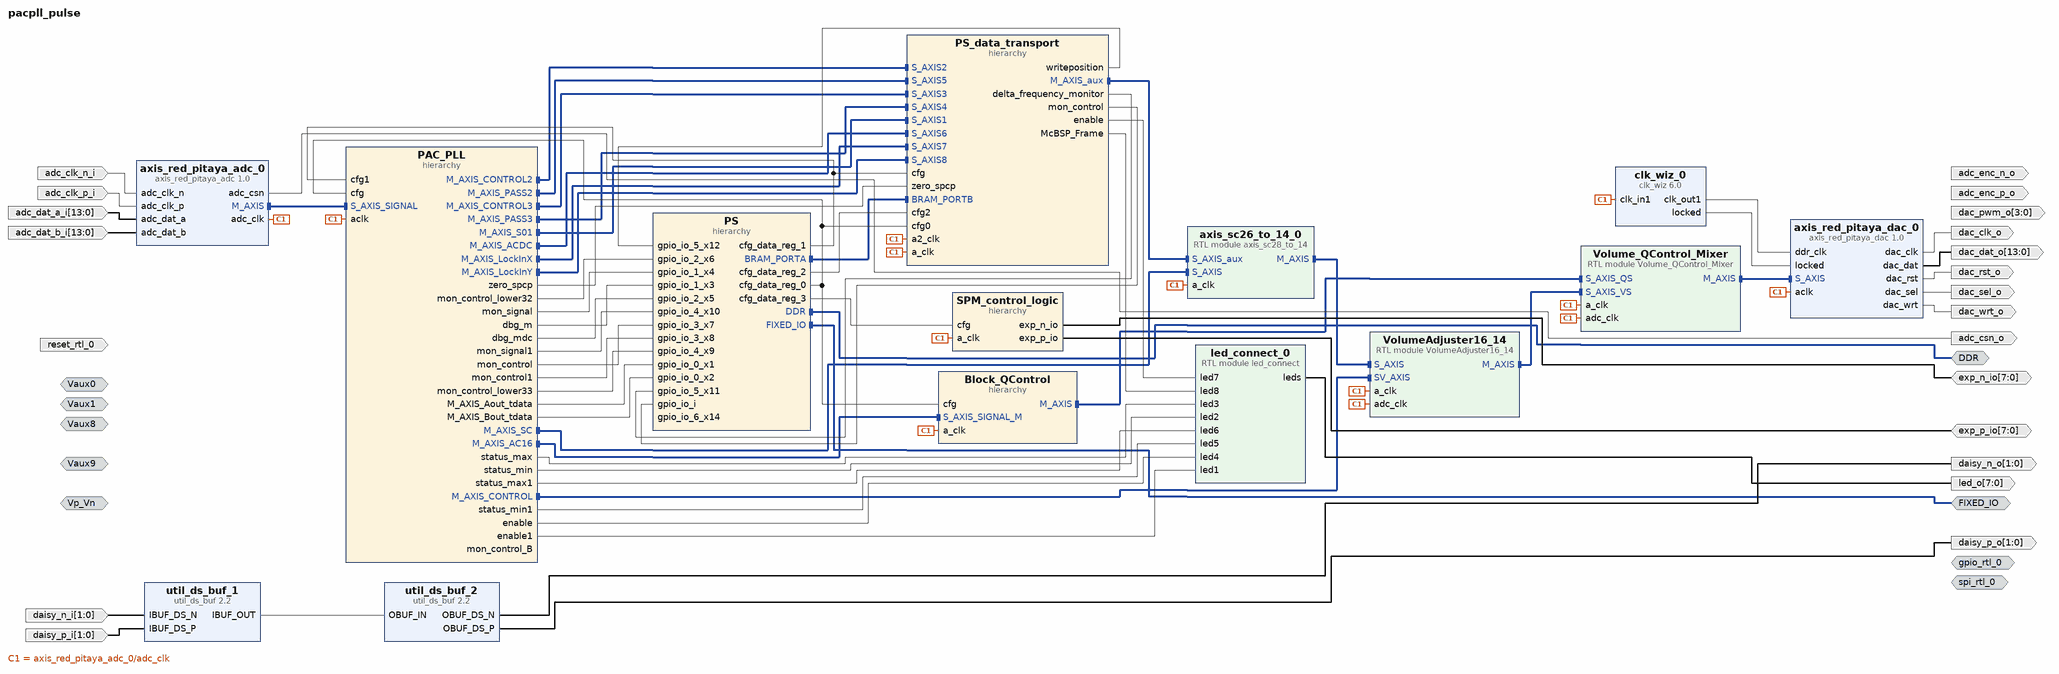
[diagram p0: block diagram of the top level]
# Vivado block design pacpll_pulse, xc7z020clg400-1, Vivado 2022.1.2
create_bd_design pacpll_pulse

create_bd_intf_port -mode Master -vlnv xilinx.com:interface:ddrx_rtl:1.0 DDR
create_bd_intf_port -mode Master -vlnv xilinx.com:display_processing_system7:fixedio_rtl:1.0 FIXED_IO
create_bd_intf_port -mode Slave -vlnv xilinx.com:interface:diff_analog_io_rtl:1.0 Vaux0
create_bd_intf_port -mode Slave -vlnv xilinx.com:interface:diff_analog_io_rtl:1.0 Vaux1
create_bd_intf_port -mode Slave -vlnv xilinx.com:interface:diff_analog_io_rtl:1.0 Vaux8
create_bd_intf_port -mode Slave -vlnv xilinx.com:interface:diff_analog_io_rtl:1.0 Vaux9
create_bd_intf_port -mode Slave -vlnv xilinx.com:interface:diff_analog_io_rtl:1.0 Vp_Vn
create_bd_intf_port -mode Master -vlnv xilinx.com:interface:gpio_rtl:1.0 gpio_rtl_0
create_bd_intf_port -mode Master -vlnv xilinx.com:interface:spi_rtl:1.0 spi_rtl_0
create_bd_port -dir I adc_clk_n_i
create_bd_port -dir I adc_clk_p_i
create_bd_port -dir O adc_csn_o
create_bd_port -dir I -from 13 -to 0 adc_dat_a_i
create_bd_port -dir I -from 13 -to 0 adc_dat_b_i
create_bd_port -dir O adc_enc_n_o
create_bd_port -dir O adc_enc_p_o
create_bd_port -dir O dac_clk_o
create_bd_port -dir O -from 13 -to 0 dac_dat_o
create_bd_port -dir O -from 3 -to 0 dac_pwm_o
create_bd_port -dir O dac_rst_o
create_bd_port -dir O dac_sel_o
create_bd_port -dir O dac_wrt_o
create_bd_port -dir I -from 1 -to 0 daisy_n_i
create_bd_port -dir O -from 1 -to 0 daisy_n_o
create_bd_port -dir I -from 1 -to 0 daisy_p_i
create_bd_port -dir O -from 1 -to 0 daisy_p_o
create_bd_port -dir IO -from 7 -to 0 exp_n_io
create_bd_port -dir IO -from 7 -to 0 exp_p_io
create_bd_port -dir O -from 7 -to 0 led_o
create_bd_port -dir I -type rst reset_rtl_0
set_property -dict {CONFIG.POLARITY ACTIVE_HIGH} [get_bd_ports reset_rtl_0]

create_bd_cell -type hier PS
create_bd_cell -type hier PS_data_transport
create_bd_cell -type module -reference VolumeAdjuster16_14 VolumeAdjuster16_14
create_bd_cell -type module -reference Volume_QControl_Mixer Volume_QControl_Mixer
create_bd_cell -type ip -vlnv pavel-demin:user:axis_red_pitaya_adc:1.0 axis_red_pitaya_adc_0
create_bd_cell -type ip -vlnv pavel-demin:user:axis_red_pitaya_dac:1.0 axis_red_pitaya_dac_0
create_bd_cell -type module -reference axis_sc28_to_14 axis_sc26_to_14_0
set_property -dict {CONFIG.SRC_BITS 25} [get_bd_cells axis_sc26_to_14_0]
create_bd_cell -type module -reference led_connect led_connect_0
create_bd_cell -type ip -vlnv xilinx.com:ip:clk_wiz:6.0 clk_wiz_0
set_property -dict [list \
  CONFIG.CLKIN1_JITTER_PS 80.0 \
  CONFIG.CLKIN2_JITTER_PS 166.66 \
  CONFIG.CLKOUT1_JITTER 104.759 \
  CONFIG.CLKOUT1_PHASE_ERROR 96.948 \
  CONFIG.CLKOUT1_REQUESTED_OUT_FREQ 250 \
  CONFIG.CLKOUT2_JITTER 137.150 \
  CONFIG.CLKOUT2_PHASE_ERROR 96.948 \
  CONFIG.CLKOUT2_REQUESTED_OUT_FREQ 62.5 \
  CONFIG.CLKOUT2_USED true \
  CONFIG.MMCM_CLKFBOUT_MULT_F 8.000 \
  CONFIG.MMCM_CLKIN1_PERIOD 8.000 \
  CONFIG.MMCM_CLKIN2_PERIOD 10.000 \
  CONFIG.MMCM_CLKOUT0_DIVIDE_F 4.000 \
  CONFIG.MMCM_CLKOUT1_DIVIDE 16 \
  CONFIG.MMCM_DIVCLK_DIVIDE 1 \
  CONFIG.NUM_OUT_CLKS 2 \
  CONFIG.PRIM_IN_FREQ 125 \
  CONFIG.SECONDARY_SOURCE Single_ended_clock_capable_pin \
  CONFIG.USE_INCLK_SWITCHOVER false \
  CONFIG.USE_RESET false \
] [get_bd_cells clk_wiz_0]
create_bd_cell -type ip -vlnv xilinx.com:ip:util_ds_buf:2.2 util_ds_buf_1
set_property -dict {CONFIG.C_SIZE 2} [get_bd_cells util_ds_buf_1]
create_bd_cell -type ip -vlnv xilinx.com:ip:util_ds_buf:2.2 util_ds_buf_2
set_property -dict {CONFIG.C_BUF_TYPE OBUFDS CONFIG.C_SIZE 2} [get_bd_cells util_ds_buf_2]
create_bd_cell -type hier PAC_PLL
create_bd_cell -type hier Block_QControl
create_bd_cell -type hier SPM_control_logic

# ---- hierarchy /PS ----
current_bd_instance /PS
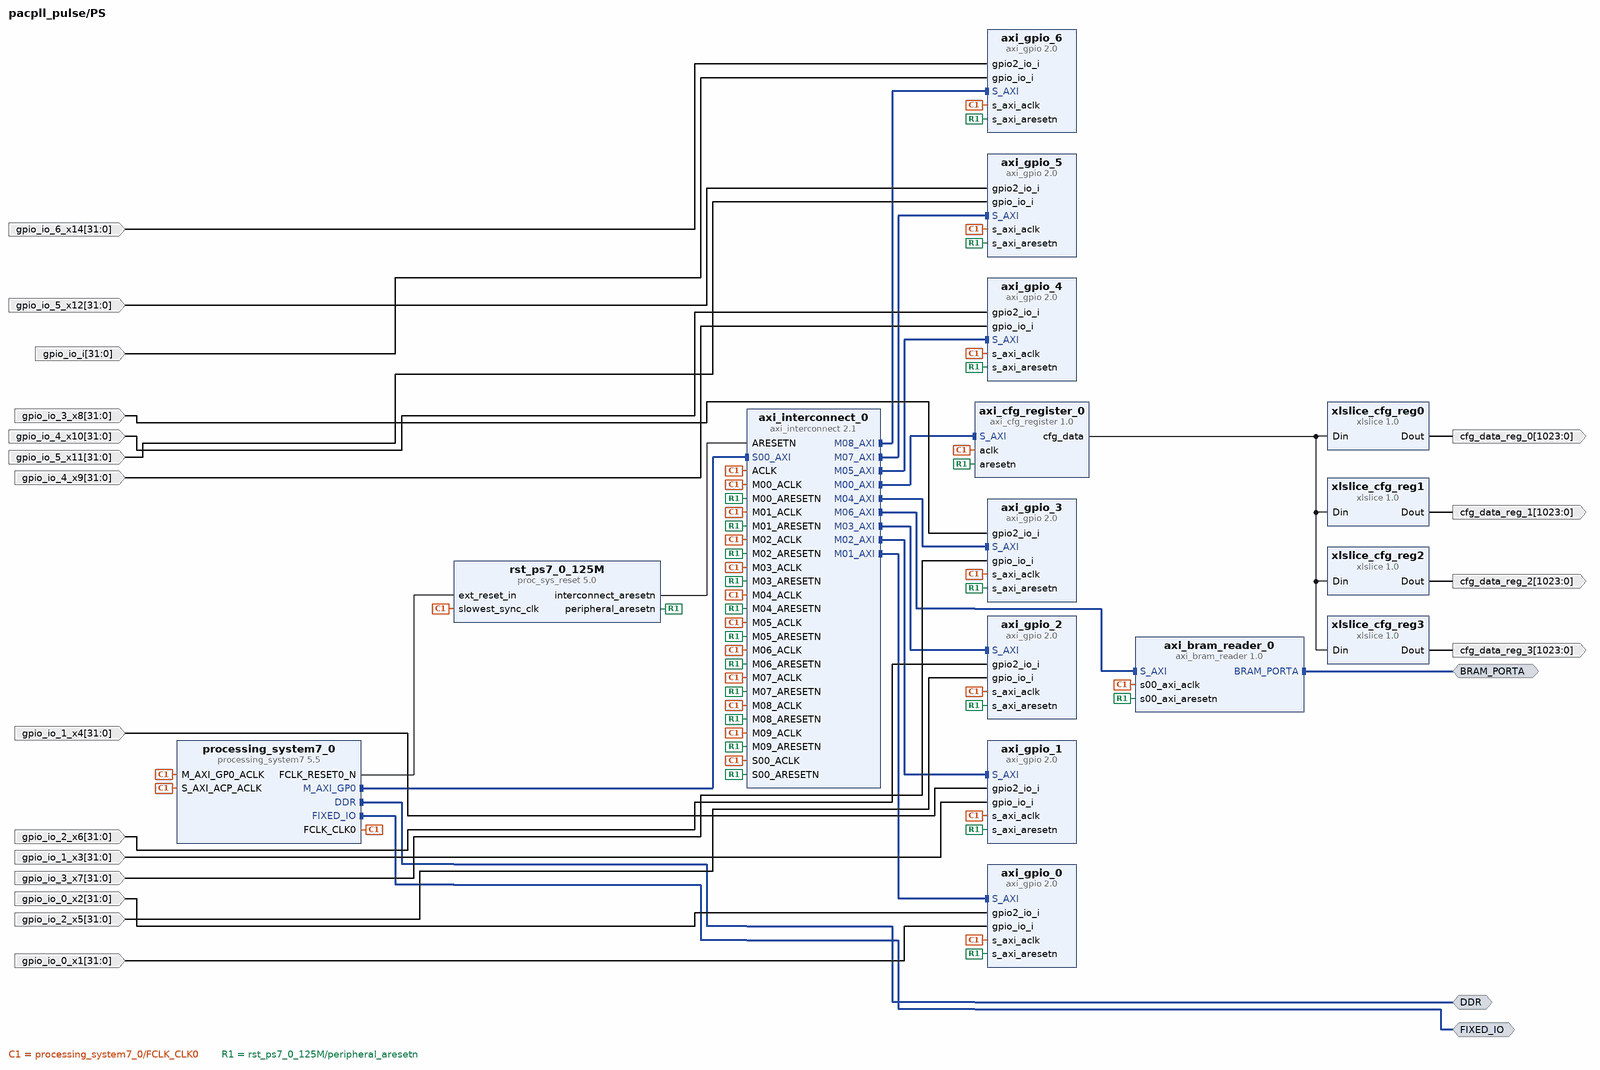
[diagram p1: block diagram inside /PS]
create_bd_intf_pin -mode Master -vlnv xilinx.com:interface:bram_rtl:1.0 BRAM_PORTA
create_bd_intf_pin -mode Master -vlnv xilinx.com:interface:ddrx_rtl:1.0 DDR
create_bd_intf_pin -mode Master -vlnv xilinx.com:display_processing_system7:fixedio_rtl:1.0 FIXED_IO
create_bd_pin -dir O -from 1023 -to 0 cfg_data_reg_0
create_bd_pin -dir O -from 1023 -to 0 cfg_data_reg_1
create_bd_pin -dir I -from 31 -to 0 gpio_io_0_x1
create_bd_pin -dir I -from 31 -to 0 gpio_io_0_x2
create_bd_pin -dir I -from 31 -to 0 gpio_io_1_x3
create_bd_pin -dir I -from 31 -to 0 gpio_io_1_x4
create_bd_pin -dir I -from 31 -to 0 gpio_io_2_x5
create_bd_pin -dir I -from 31 -to 0 gpio_io_2_x6
create_bd_pin -dir I -from 31 -to 0 gpio_io_3_x7
create_bd_pin -dir I -from 31 -to 0 gpio_io_3_x8
create_bd_pin -dir I -from 31 -to 0 gpio_io_4_x9
create_bd_pin -dir I -from 31 -to 0 gpio_io_4_x10
create_bd_pin -dir I -from 31 -to 0 gpio_io_5_x11
create_bd_pin -dir I -from 31 -to 0 gpio_io_5_x12
create_bd_pin -dir I -from 31 -to 0 gpio_io_6_x14
create_bd_pin -dir O -from 1023 -to 0 cfg_data_reg_2
create_bd_pin -dir O -from 1023 -to 0 cfg_data_reg_3
create_bd_pin -dir I -from 31 -to 0 gpio_io_i

create_bd_cell -type ip -vlnv anton-potocnik:user:axi_bram_reader:1.0 axi_bram_reader_0
set_property -dict {CONFIG.BRAM_ADDR_WIDTH 14 CONFIG.C_S00_AXI_ADDR_WIDTH 16} [get_bd_cells axi_bram_reader_0]
create_bd_cell -type ip -vlnv pavel-demin:user:axi_cfg_register:1.0 axi_cfg_register_0
set_property -dict [list \
  CONFIG.AXI_ADDR_WIDTH 16 \
  CONFIG.AXI_DATA_WIDTH 32 \
  CONFIG.CFG_DATA_WIDTH 4096 \
] [get_bd_cells axi_cfg_register_0]
create_bd_cell -type ip -vlnv xilinx.com:ip:processing_system7:5.5 processing_system7_0
set_property -dict [list \
  CONFIG.PCW_APU_PERIPHERAL_FREQMHZ 666.666666 \
  CONFIG.PCW_ENET0_ENET0_IO {MIO 16 .. 27} \
  CONFIG.PCW_ENET0_GRP_MDIO_ENABLE 1 \
  CONFIG.PCW_ENET0_GRP_MDIO_IO EMIO \
  CONFIG.PCW_ENET0_PERIPHERAL_ENABLE 1 \
  CONFIG.PCW_ENET0_RESET_ENABLE 0 \
  CONFIG.PCW_ENET_RESET_ENABLE 1 \
  CONFIG.PCW_ENET_RESET_SELECT {Share reset pin} \
  CONFIG.PCW_EN_CLK1_PORT 1 \
  CONFIG.PCW_FCLK_CLK1_BUF TRUE \
  CONFIG.PCW_FPGA0_PERIPHERAL_FREQMHZ 100 \
  CONFIG.PCW_FPGA1_PERIPHERAL_FREQMHZ 20 \
  CONFIG.PCW_FPGA3_PERIPHERAL_FREQMHZ 200 \
  CONFIG.PCW_FPGA_FCLK1_ENABLE 1 \
  CONFIG.PCW_GPIO_MIO_GPIO_ENABLE 1 \
  CONFIG.PCW_GPIO_MIO_GPIO_IO MIO \
  CONFIG.PCW_GPIO_PERIPHERAL_ENABLE 1 \
  CONFIG.PCW_I2C0_GRP_INT_ENABLE 0 \
  CONFIG.PCW_I2C0_I2C0_IO {MIO 50 .. 51} \
  CONFIG.PCW_I2C0_PERIPHERAL_ENABLE 1 \
  CONFIG.PCW_I2C_PERIPHERAL_FREQMHZ 111.111115 \
  CONFIG.PCW_I2C_RESET_ENABLE 1 \
  CONFIG.PCW_I2C_RESET_SELECT {Share reset pin} \
  CONFIG.PCW_IMPORT_BOARD_PRESET cfg/red_pitaya.xml \
  CONFIG.PCW_PERIPHERAL_BOARD_PRESET None \
  CONFIG.PCW_PRESET_BANK1_VOLTAGE {LVCMOS 2.5V} \
  CONFIG.PCW_QSPI_GRP_SINGLE_SS_ENABLE 1 \
  CONFIG.PCW_QSPI_GRP_SINGLE_SS_IO {MIO 1 .. 6} \
  CONFIG.PCW_QSPI_PERIPHERAL_ENABLE 1 \
  CONFIG.PCW_QSPI_PERIPHERAL_FREQMHZ 125 \
  CONFIG.PCW_QSPI_QSPI_IO {MIO 1 .. 6} \
  CONFIG.PCW_SD0_GRP_CD_ENABLE 1 \
  CONFIG.PCW_SD0_GRP_CD_IO {MIO 46} \
  CONFIG.PCW_SD0_GRP_WP_ENABLE 1 \
  CONFIG.PCW_SD0_GRP_WP_IO {MIO 47} \
  CONFIG.PCW_SD0_PERIPHERAL_ENABLE 1 \
  CONFIG.PCW_SD0_SD0_IO {MIO 40 .. 45} \
  CONFIG.PCW_SDIO_PERIPHERAL_FREQMHZ 100 \
  CONFIG.PCW_SINGLE_QSPI_DATA_MODE x4 \
  CONFIG.PCW_SPI0_PERIPHERAL_ENABLE 1 \
  CONFIG.PCW_SPI0_SPI0_IO EMIO \
  CONFIG.PCW_SPI1_PERIPHERAL_ENABLE 1 \
  CONFIG.PCW_SPI1_SPI1_IO {MIO 10 .. 15} \
  CONFIG.PCW_TTC0_PERIPHERAL_ENABLE 1 \
  CONFIG.PCW_TTC0_TTC0_IO EMIO \
  CONFIG.PCW_UART0_PERIPHERAL_ENABLE 1 \
  CONFIG.PCW_UART0_UART0_IO {MIO 14 .. 15} \
  CONFIG.PCW_UART1_PERIPHERAL_ENABLE 1 \
  CONFIG.PCW_UART1_UART1_IO {MIO 8 .. 9} \
  CONFIG.PCW_UART_PERIPHERAL_FREQMHZ 100 \
  CONFIG.PCW_UIPARAM_DDR_BUS_WIDTH {16 Bit} \
  CONFIG.PCW_UIPARAM_DDR_FREQ_MHZ 533.333333 \
  CONFIG.PCW_UIPARAM_DDR_PARTNO {MT41J256M16 RE-125} \
  CONFIG.PCW_USB0_PERIPHERAL_ENABLE 1 \
  CONFIG.PCW_USB0_RESET_ENABLE 1 \
  CONFIG.PCW_USB0_RESET_IO {MIO 48} \
  CONFIG.PCW_USB0_USB0_IO {MIO 28 .. 39} \
  CONFIG.PCW_USB_RESET_ENABLE 1 \
  CONFIG.PCW_USB_RESET_SELECT {Share reset pin} \
  CONFIG.PCW_USE_S_AXI_ACP 1 \
] [get_bd_cells processing_system7_0]
# 508 more settings of processing_system7_0 are not shown: defaults, MIO pin electricals, DDR timing, and values the tool derives
create_bd_cell -type ip -vlnv xilinx.com:ip:proc_sys_reset:5.0 rst_ps7_0_125M
create_bd_cell -type ip -vlnv xilinx.com:ip:xlslice:1.0 xlslice_cfg_reg0
set_property -dict {CONFIG.DIN_FROM 1023 CONFIG.DIN_WIDTH 4096 CONFIG.DOUT_WIDTH 1024} [get_bd_cells xlslice_cfg_reg0]
create_bd_cell -type ip -vlnv xilinx.com:ip:xlslice:1.0 xlslice_cfg_reg1
set_property -dict [list \
  CONFIG.DIN_FROM 2047 \
  CONFIG.DIN_TO 1024 \
  CONFIG.DIN_WIDTH 4096 \
  CONFIG.DOUT_WIDTH 1024 \
] [get_bd_cells xlslice_cfg_reg1]
create_bd_cell -type ip -vlnv xilinx.com:ip:xlslice:1.0 xlslice_cfg_reg2
set_property -dict [list \
  CONFIG.DIN_FROM 3071 \
  CONFIG.DIN_TO 2048 \
  CONFIG.DIN_WIDTH 4096 \
  CONFIG.DOUT_WIDTH 1024 \
] [get_bd_cells xlslice_cfg_reg2]
create_bd_cell -type ip -vlnv xilinx.com:ip:axi_gpio:2.0 axi_gpio_0
set_property -dict {CONFIG.C_ALL_INPUTS 1 CONFIG.C_ALL_INPUTS_2 1 CONFIG.C_IS_DUAL 1} [get_bd_cells axi_gpio_0]
create_bd_cell -type ip -vlnv xilinx.com:ip:axi_gpio:2.0 axi_gpio_1
set_property -dict {CONFIG.C_ALL_INPUTS 1 CONFIG.C_ALL_INPUTS_2 1 CONFIG.C_IS_DUAL 1} [get_bd_cells axi_gpio_1]
create_bd_cell -type ip -vlnv xilinx.com:ip:axi_gpio:2.0 axi_gpio_2
set_property -dict {CONFIG.C_ALL_INPUTS 1 CONFIG.C_ALL_INPUTS_2 1 CONFIG.C_IS_DUAL 1} [get_bd_cells axi_gpio_2]
create_bd_cell -type ip -vlnv xilinx.com:ip:axi_gpio:2.0 axi_gpio_3
set_property -dict {CONFIG.C_ALL_INPUTS 1 CONFIG.C_ALL_INPUTS_2 1 CONFIG.C_IS_DUAL 1} [get_bd_cells axi_gpio_3]
create_bd_cell -type ip -vlnv xilinx.com:ip:axi_gpio:2.0 axi_gpio_4
set_property -dict {CONFIG.C_ALL_INPUTS 1 CONFIG.C_ALL_INPUTS_2 1 CONFIG.C_IS_DUAL 1} [get_bd_cells axi_gpio_4]
create_bd_cell -type ip -vlnv xilinx.com:ip:axi_gpio:2.0 axi_gpio_5
set_property -dict {CONFIG.C_ALL_INPUTS 1 CONFIG.C_ALL_INPUTS_2 1 CONFIG.C_IS_DUAL 1} [get_bd_cells axi_gpio_5]
create_bd_cell -type ip -vlnv xilinx.com:ip:axi_gpio:2.0 axi_gpio_6
set_property -dict {CONFIG.C_ALL_INPUTS 1 CONFIG.C_ALL_INPUTS_2 1 CONFIG.C_IS_DUAL 1} [get_bd_cells axi_gpio_6]
create_bd_cell -type ip -vlnv xilinx.com:ip:axi_interconnect:2.1 axi_interconnect_0
set_property -dict {CONFIG.NUM_MI 10} [get_bd_cells axi_interconnect_0]
create_bd_cell -type ip -vlnv xilinx.com:ip:xlslice:1.0 xlslice_cfg_reg3
set_property -dict [list \
  CONFIG.DIN_FROM 4095 \
  CONFIG.DIN_TO 3072 \
  CONFIG.DIN_WIDTH 4096 \
  CONFIG.DOUT_WIDTH 1024 \
] [get_bd_cells xlslice_cfg_reg3]

# ---- hierarchy /PS_data_transport ----
current_bd_instance /PS_data_transport
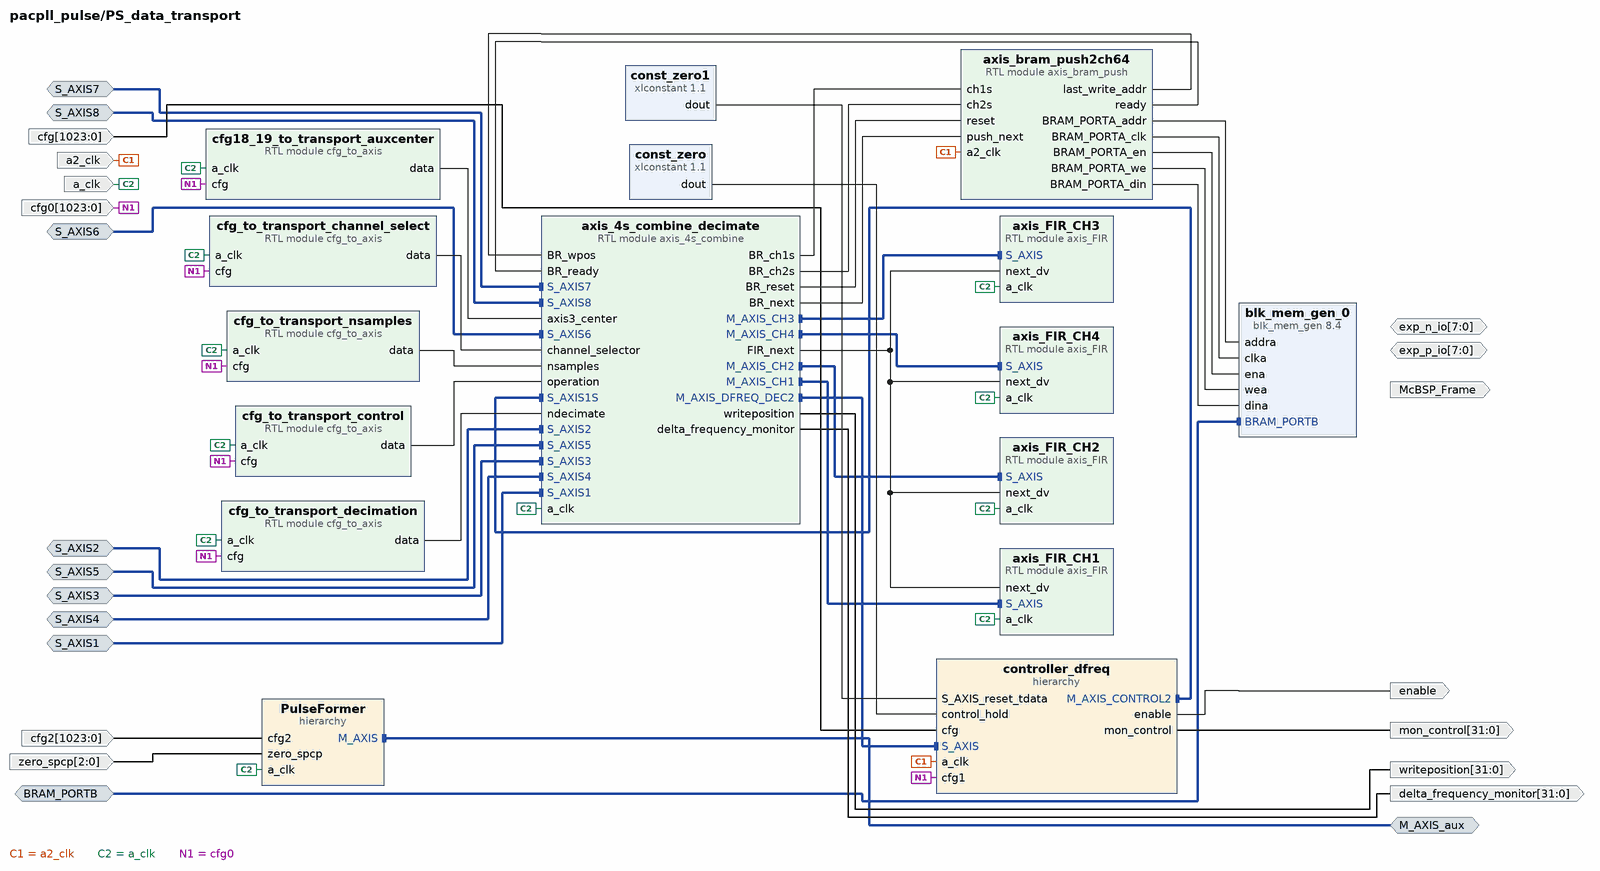
[diagram p2: block diagram inside /PS_data_transport]
create_bd_intf_pin -mode Slave -vlnv xilinx.com:interface:bram_rtl:1.0 BRAM_PORTB
create_bd_intf_pin -mode Master -vlnv xilinx.com:interface:axis_rtl:1.0 M_AXIS_aux
create_bd_intf_pin -mode Slave -vlnv xilinx.com:interface:axis_rtl:1.0 S_AXIS1
create_bd_intf_pin -mode Slave -vlnv xilinx.com:interface:axis_rtl:1.0 S_AXIS2
create_bd_intf_pin -mode Slave -vlnv xilinx.com:interface:axis_rtl:1.0 S_AXIS3
create_bd_intf_pin -mode Slave -vlnv xilinx.com:interface:axis_rtl:1.0 S_AXIS4
create_bd_intf_pin -mode Slave -vlnv xilinx.com:interface:axis_rtl:1.0 S_AXIS5
create_bd_intf_pin -mode Slave -vlnv xilinx.com:interface:axis_rtl:1.0 S_AXIS6
create_bd_intf_pin -mode Slave -vlnv xilinx.com:interface:axis_rtl:1.0 S_AXIS7
create_bd_intf_pin -mode Slave -vlnv xilinx.com:interface:axis_rtl:1.0 S_AXIS8
create_bd_pin -dir O McBSP_Frame
create_bd_pin -dir I -type clk a2_clk
create_bd_pin -dir I -type clk a_clk
create_bd_pin -dir I -from 1023 -to 0 cfg0
create_bd_pin -dir IO -from 7 -to 0 exp_n_io
create_bd_pin -dir IO -from 7 -to 0 exp_p_io
create_bd_pin -dir O -from 31 -to 0 writeposition
create_bd_pin -dir O -from 31 -to 0 delta_frequency_monitor
create_bd_pin -dir I -from 2 -to 0 zero_spcp
create_bd_pin -dir I -from 1023 -to 0 cfg2
create_bd_pin -dir O -from 31 -to 0 mon_control
create_bd_pin -dir O enable
create_bd_pin -dir I -from 1023 -to 0 cfg

create_bd_cell -type module -reference axis_FIR axis_FIR_CH1
set_property -dict {CONFIG.FIR_DECI 64 CONFIG.FIR_DECI_L 6} [get_bd_cells axis_FIR_CH1]
create_bd_cell -type module -reference axis_FIR axis_FIR_CH2
set_property -dict {CONFIG.FIR_DECI 64 CONFIG.FIR_DECI_L 6} [get_bd_cells axis_FIR_CH2]
create_bd_cell -type module -reference axis_bram_push axis_bram_push2ch64
set_property -dict {CONFIG.BRAM_ADDR_WIDTH 14 CONFIG.BRAM_DATA_WIDTH 32} [get_bd_cells axis_bram_push2ch64]
create_bd_cell -type module -reference cfg_to_axis cfg18_19_to_transport_auxcenter
set_property -dict [list \
  CONFIG.DST_WIDTH 48 \
  CONFIG.MAXIS_TDATA_WIDTH 48 \
  CONFIG.SRC_ADDR 18 \
  CONFIG.SRC_BITS 64 \
] [get_bd_cells cfg18_19_to_transport_auxcenter]
create_bd_cell -type module -reference cfg_to_axis cfg_to_transport_channel_select
set_property -dict [list \
  CONFIG.DST_WIDTH 32 \
  CONFIG.MAXIS_TDATA_WIDTH 32 \
  CONFIG.SRC_ADDR 9 \
] [get_bd_cells cfg_to_transport_channel_select]
create_bd_cell -type module -reference cfg_to_axis cfg_to_transport_control
set_property -dict {CONFIG.DST_WIDTH 32 CONFIG.MAXIS_TDATA_WIDTH 32 CONFIG.SRC_ADDR 6} [get_bd_cells cfg_to_transport_control]
create_bd_cell -type module -reference cfg_to_axis cfg_to_transport_decimation
set_property -dict {CONFIG.DST_WIDTH 32 CONFIG.MAXIS_TDATA_WIDTH 32 CONFIG.SRC_ADDR 8} [get_bd_cells cfg_to_transport_decimation]
create_bd_cell -type module -reference cfg_to_axis cfg_to_transport_nsamples
set_property -dict {CONFIG.DST_WIDTH 32 CONFIG.MAXIS_TDATA_WIDTH 32 CONFIG.SRC_ADDR 7} [get_bd_cells cfg_to_transport_nsamples]
create_bd_cell -type module -reference axis_4s_combine axis_4s_combine_decimate
set_property -dict {CONFIG.BRAM_ADDR_WIDTH 15 CONFIG.BRAM_DATA_WIDTH 64} [get_bd_cells axis_4s_combine_decimate]
create_bd_cell -type module -reference axis_FIR axis_FIR_CH3
set_property -dict {CONFIG.FIR_DECI 64 CONFIG.FIR_DECI_L 6} [get_bd_cells axis_FIR_CH3]
create_bd_cell -type module -reference axis_FIR axis_FIR_CH4
set_property -dict {CONFIG.FIR_DECI 64 CONFIG.FIR_DECI_L 6} [get_bd_cells axis_FIR_CH4]
create_bd_cell -type ip -vlnv xilinx.com:ip:blk_mem_gen:8.4 blk_mem_gen_0
set_property -dict [list \
  CONFIG.Algorithm Minimum_Area \
  CONFIG.Enable_32bit_Address false \
  CONFIG.Enable_B Use_ENB_Pin \
  CONFIG.Memory_Type Simple_Dual_Port_RAM \
  CONFIG.Operating_Mode_A NO_CHANGE \
  CONFIG.Port_B_Clock 100 \
  CONFIG.Port_B_Enable_Rate 100 \
  CONFIG.Read_Width_B 32 \
  CONFIG.Register_PortB_Output_of_Memory_Primitives true \
  CONFIG.Use_Byte_Write_Enable false \
  CONFIG.Use_RSTB_Pin false \
  CONFIG.Write_Depth_A 16384 \
  CONFIG.Write_Width_A 32 \
  CONFIG.Write_Width_B 32 \
  CONFIG.use_bram_block Stand_Alone \
] [get_bd_cells blk_mem_gen_0]
create_bd_cell -type ip -vlnv xilinx.com:ip:xlconstant:1.1 const_zero1
set_property -dict {CONFIG.CONST_VAL 0 CONFIG.CONST_WIDTH 32} [get_bd_cells const_zero1]
create_bd_cell -type ip -vlnv xilinx.com:ip:xlconstant:1.1 const_zero
set_property -dict {CONFIG.CONST_VAL 0} [get_bd_cells const_zero]
create_bd_cell -type hier controller_dfreq
create_bd_cell -type hier PulseFormer

# ---- hierarchy /PS_data_transport/controller_dfreq ----
current_bd_instance /PS_data_transport/controller_dfreq
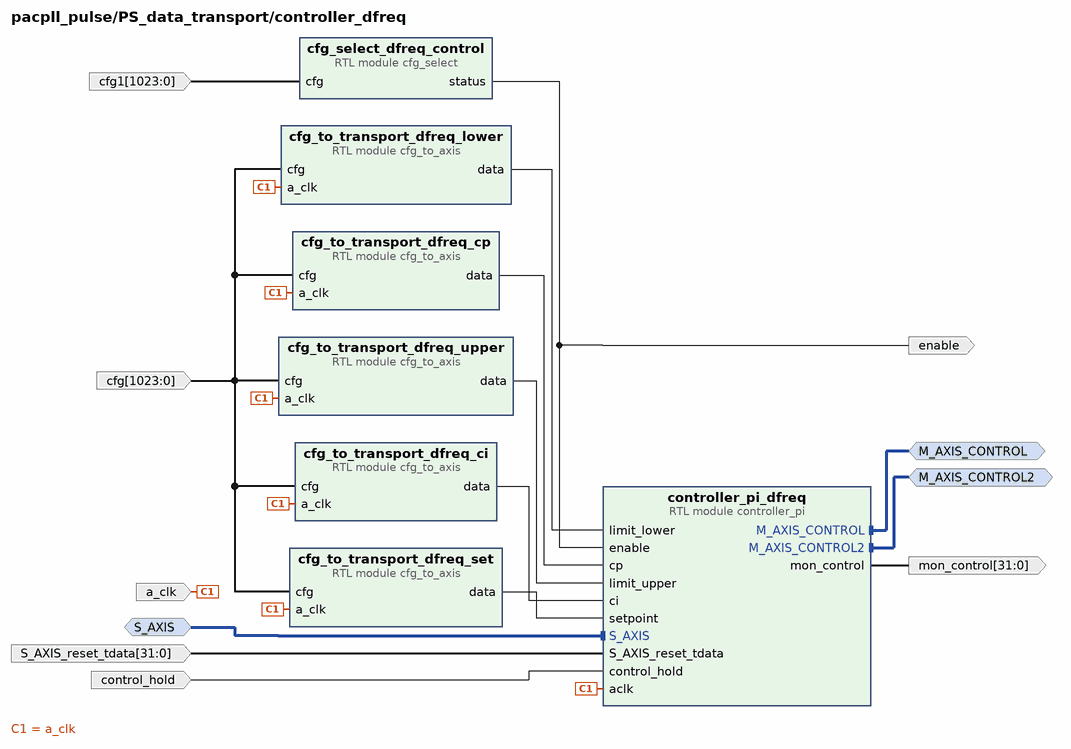
[diagram p3: block diagram inside /PS_data_transport/controller_dfreq]
create_bd_intf_pin -mode Master -vlnv xilinx.com:interface:axis_rtl:1.0 M_AXIS_CONTROL
create_bd_intf_pin -mode Master -vlnv xilinx.com:interface:axis_rtl:1.0 M_AXIS_CONTROL2
create_bd_intf_pin -mode Slave -vlnv xilinx.com:interface:axis_rtl:1.0 S_AXIS
create_bd_pin -dir I -from 1023 -to 0 cfg
create_bd_pin -dir I -type clk a_clk
create_bd_pin -dir I -from 1023 -to 0 cfg1
create_bd_pin -dir O enable
create_bd_pin -dir I -from 31 -to 0 S_AXIS_reset_tdata
create_bd_pin -dir I control_hold
create_bd_pin -dir O -from 31 -to 0 mon_control

create_bd_cell -type module -reference cfg_to_axis cfg_to_transport_dfreq_set
set_property -dict {CONFIG.CFG_WIDTH 1024 CONFIG.SRC_ADDR 0} [get_bd_cells cfg_to_transport_dfreq_set]
create_bd_cell -type module -reference cfg_select cfg_select_dfreq_control
set_property -dict {CONFIG.CFG_SWBIT 8 CONFIG.SRC_ADDR 3} [get_bd_cells cfg_select_dfreq_control]
create_bd_cell -type module -reference cfg_to_axis cfg_to_transport_dfreq_ci
set_property -dict {CONFIG.CFG_WIDTH 1024 CONFIG.SRC_ADDR 2} [get_bd_cells cfg_to_transport_dfreq_ci]
create_bd_cell -type module -reference cfg_to_axis cfg_to_transport_dfreq_cp
set_property -dict {CONFIG.CFG_WIDTH 1024 CONFIG.SRC_ADDR 1} [get_bd_cells cfg_to_transport_dfreq_cp]
create_bd_cell -type module -reference cfg_to_axis cfg_to_transport_dfreq_lower
set_property -dict {CONFIG.CFG_WIDTH 1024 CONFIG.SRC_ADDR 5} [get_bd_cells cfg_to_transport_dfreq_lower]
create_bd_cell -type module -reference cfg_to_axis cfg_to_transport_dfreq_upper
set_property -dict {CONFIG.CFG_WIDTH 1024 CONFIG.SRC_ADDR 3} [get_bd_cells cfg_to_transport_dfreq_upper]
create_bd_cell -type module -reference controller_pi controller_pi_dfreq
set_property -dict [list \
  CONFIG.CONTROL_W 32 \
  CONFIG.IN_Q 24 \
  CONFIG.IN_W 25 \
  CONFIG.M_AXIS_CONTROL2_TDATA_WIDTH 32 \
  CONFIG.M_AXIS_CONTROL_TDATA_WIDTH 32 \
  CONFIG.USE_RESET_DATA_INPUT 0 \
] [get_bd_cells controller_pi_dfreq]

# ---- hierarchy /PS_data_transport/PulseFormer ----
current_bd_instance /PS_data_transport/PulseFormer
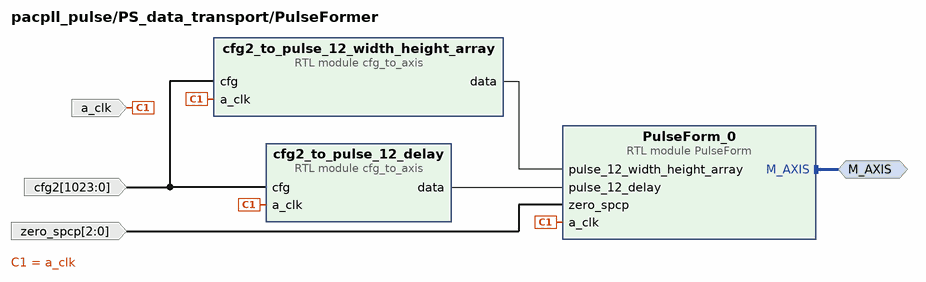
[diagram p4: block diagram inside /PS_data_transport/PulseFormer]
create_bd_intf_pin -mode Master -vlnv xilinx.com:interface:axis_rtl:1.0 M_AXIS
create_bd_pin -dir I -from 1023 -to 0 cfg2
create_bd_pin -dir I -type clk a_clk
create_bd_pin -dir I -from 2 -to 0 zero_spcp

create_bd_cell -type module -reference cfg_to_axis cfg2_to_pulse_12_width_height_array
set_property -dict [list \
  CONFIG.DST_WIDTH 462 \
  CONFIG.MAXIS_TDATA_WIDTH 462 \
  CONFIG.SRC_ADDR 1 \
  CONFIG.SRC_BITS 462 \
] [get_bd_cells cfg2_to_pulse_12_width_height_array]
create_bd_cell -type module -reference cfg_to_axis cfg2_to_pulse_12_delay
set_property -dict [list \
  CONFIG.DST_WIDTH 32 \
  CONFIG.MAXIS_TDATA_WIDTH 32 \
  CONFIG.SRC_ADDR 0 \
  CONFIG.SRC_BITS 32 \
] [get_bd_cells cfg2_to_pulse_12_delay]
create_bd_cell -type module -reference PulseForm PulseForm_0

# ---- hierarchy /PAC_PLL ----
current_bd_instance /PAC_PLL
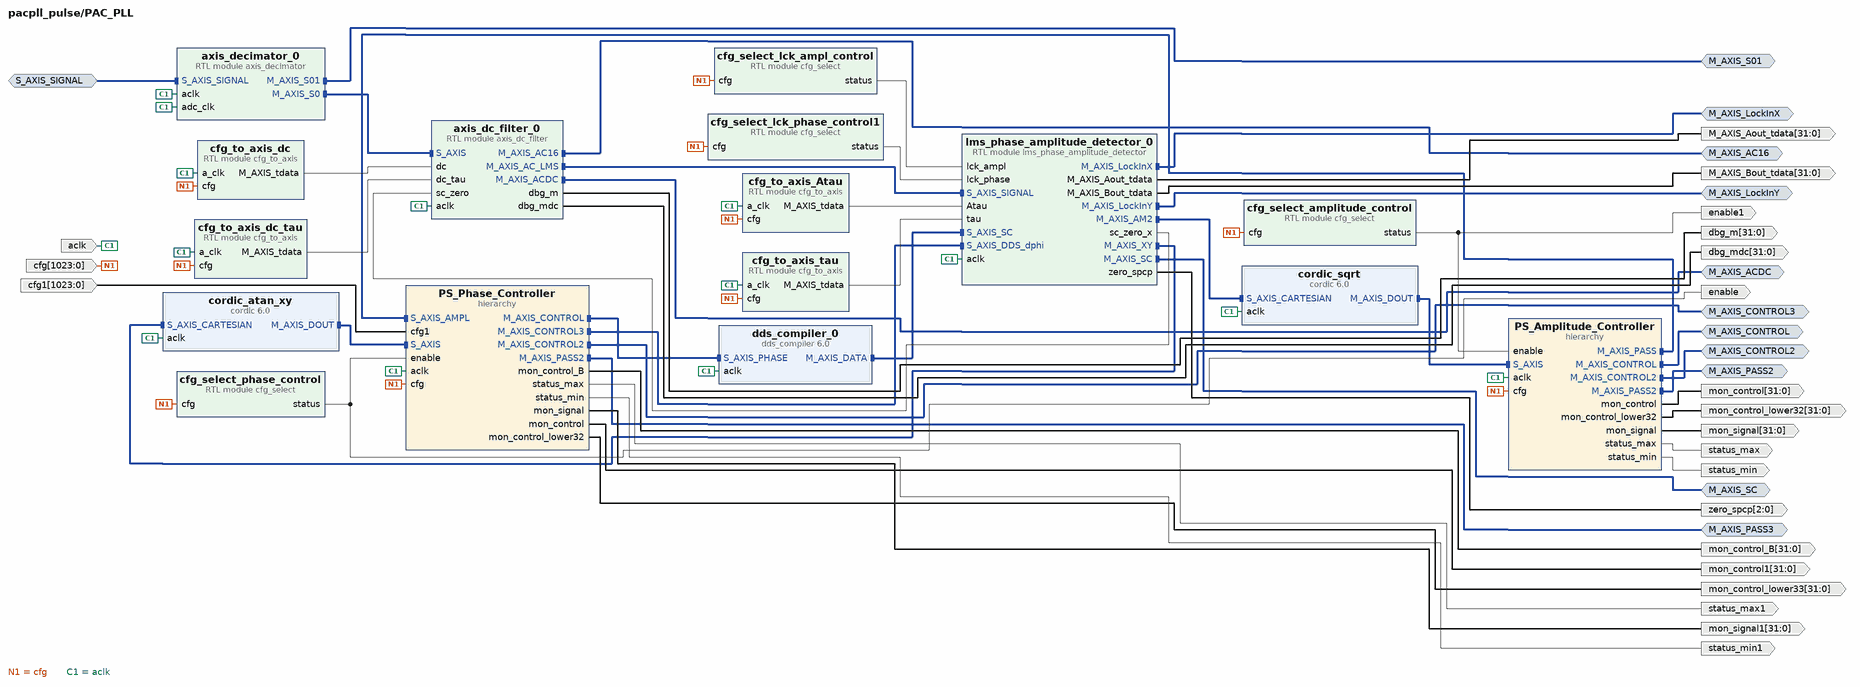
[diagram p5: block diagram inside /PAC_PLL]
create_bd_intf_pin -mode Master -vlnv xilinx.com:interface:axis_rtl:1.0 M_AXIS_S01
create_bd_intf_pin -mode Slave -vlnv xilinx.com:interface:axis_rtl:1.0 S_AXIS_SIGNAL
create_bd_intf_pin -mode Master -vlnv xilinx.com:interface:axis_rtl:1.0 M_AXIS_LockInX
create_bd_intf_pin -mode Master -vlnv xilinx.com:interface:axis_rtl:1.0 M_AXIS_LockInY
create_bd_intf_pin -mode Master -vlnv xilinx.com:interface:axis_rtl:1.0 M_AXIS_SC
create_bd_intf_pin -mode Master -vlnv xilinx.com:interface:axis_rtl:1.0 M_AXIS_AC16
create_bd_intf_pin -mode Master -vlnv xilinx.com:interface:axis_rtl:1.0 M_AXIS_ACDC
create_bd_intf_pin -mode Master -vlnv xilinx.com:interface:axis_rtl:1.0 M_AXIS_CONTROL
create_bd_intf_pin -mode Master -vlnv xilinx.com:interface:axis_rtl:1.0 M_AXIS_CONTROL2
create_bd_intf_pin -mode Master -vlnv xilinx.com:interface:axis_rtl:1.0 M_AXIS_PASS2
create_bd_intf_pin -mode Master -vlnv xilinx.com:interface:axis_rtl:1.0 M_AXIS_CONTROL3
create_bd_intf_pin -mode Master -vlnv xilinx.com:interface:axis_rtl:1.0 M_AXIS_PASS3
create_bd_pin -dir I -from 1023 -to 0 cfg
create_bd_pin -dir O enable
create_bd_pin -dir I -type clk aclk
create_bd_pin -dir O enable1
create_bd_pin -dir O -from 31 -to 0 M_AXIS_Aout_tdata
create_bd_pin -dir O -from 31 -to 0 M_AXIS_Bout_tdata
create_bd_pin -dir O -from 2 -to 0 zero_spcp
create_bd_pin -dir O -from 31 -to 0 dbg_m
create_bd_pin -dir O -from 31 -to 0 dbg_mdc
create_bd_pin -dir O -from 31 -to 0 mon_control
create_bd_pin -dir O -from 31 -to 0 mon_control_lower32
create_bd_pin -dir O -from 31 -to 0 mon_signal
create_bd_pin -dir O status_max
create_bd_pin -dir O status_min
create_bd_pin -dir O -from 31 -to 0 mon_control1
create_bd_pin -dir O -from 31 -to 0 mon_control_B
create_bd_pin -dir O -from 31 -to 0 mon_control_lower33
create_bd_pin -dir O -from 31 -to 0 mon_signal1
create_bd_pin -dir O status_max1
create_bd_pin -dir O status_min1
create_bd_pin -dir I -from 1023 -to 0 cfg1

create_bd_cell -type module -reference cfg_select cfg_select_phase_control
set_property -dict {CONFIG.SRC_ADDR 3} [get_bd_cells cfg_select_phase_control]
create_bd_cell -type module -reference cfg_to_axis cfg_to_axis_dc
set_property -dict {CONFIG.DST_WIDTH 32 CONFIG.MAXIS_TDATA_WIDTH 32 CONFIG.SRC_ADDR 5} [get_bd_cells cfg_to_axis_dc]
create_bd_cell -type module -reference cfg_to_axis cfg_to_axis_tau
set_property -dict {CONFIG.DST_WIDTH 32 CONFIG.MAXIS_TDATA_WIDTH 32 CONFIG.SRC_ADDR 4} [get_bd_cells cfg_to_axis_tau]
create_bd_cell -type module -reference cfg_select cfg_select_amplitude_control
set_property -dict {CONFIG.CFG_SWBIT 1 CONFIG.SRC_ADDR 3} [get_bd_cells cfg_select_amplitude_control]
create_bd_cell -type module -reference axis_decimator axis_decimator_0
create_bd_cell -type ip -vlnv xilinx.com:ip:cordic:6.0 cordic_sqrt
set_property -dict [list \
  CONFIG.Coarse_Rotation false \
  CONFIG.Data_Format UnsignedFraction \
  CONFIG.Functional_Selection Square_Root \
  CONFIG.Input_Width 45 \
  CONFIG.Output_Width 24 \
  CONFIG.Pipelining_Mode Optimal \
  CONFIG.Round_Mode Nearest_Even \
] [get_bd_cells cordic_sqrt]
create_bd_cell -type module -reference cfg_to_axis cfg_to_axis_Atau
set_property -dict {CONFIG.SRC_ADDR 27} [get_bd_cells cfg_to_axis_Atau]
create_bd_cell -type module -reference cfg_to_axis cfg_to_axis_dc_tau
set_property -dict {CONFIG.SRC_ADDR 28} [get_bd_cells cfg_to_axis_dc_tau]
create_bd_cell -type module -reference cfg_select cfg_select_lck_phase_control1
set_property -dict {CONFIG.CFG_SWBIT 5 CONFIG.SRC_ADDR 3} [get_bd_cells cfg_select_lck_phase_control1]
create_bd_cell -type module -reference lms_phase_amplitude_detector lms_phase_amplitude_detector_0
set_property -dict [list \
  CONFIG.COMPUTE_LOCKIN 0 \
  CONFIG.SC_DATA_WIDTH 25 \
  CONFIG.USE_DUAL_PAC 2 \
] [get_bd_cells lms_phase_amplitude_detector_0]
create_bd_cell -type ip -vlnv xilinx.com:ip:dds_compiler:6.0 dds_compiler_0
set_property -dict [list \
  CONFIG.DATA_Has_TLAST Not_Required \
  CONFIG.DDS_Clock_Rate 125 \
  CONFIG.Frequency_Resolution 0.00001 \
  CONFIG.Has_Phase_Out false \
  CONFIG.Latency 10 \
  CONFIG.M_DATA_Has_TUSER Not_Required \
  CONFIG.Noise_Shaping Auto \
  CONFIG.Output_Frequency1 0 \
  CONFIG.Output_Width 25 \
  CONFIG.PINC1 0 \
  CONFIG.Phase_Increment Streaming \
  CONFIG.Phase_Width 44 \
  CONFIG.Phase_offset None \
  CONFIG.S_PHASE_Has_TUSER Not_Required \
  CONFIG.Spurious_Free_Dynamic_Range 140 \
] [get_bd_cells dds_compiler_0]
create_bd_cell -type module -reference cfg_select cfg_select_lck_ampl_control
set_property -dict {CONFIG.CFG_SWBIT 4 CONFIG.SRC_ADDR 3} [get_bd_cells cfg_select_lck_ampl_control]
create_bd_cell -type module -reference axis_dc_filter axis_dc_filter_0
create_bd_cell -type ip -vlnv xilinx.com:ip:cordic:6.0 cordic_atan_xy
set_property -dict [list \
  CONFIG.Coarse_Rotation true \
  CONFIG.Data_Format SignedFraction \
  CONFIG.Functional_Selection Arc_Tan \
  CONFIG.Input_Width 28 \
  CONFIG.Output_Width 24 \
  CONFIG.Pipelining_Mode Optimal \
  CONFIG.Round_Mode Nearest_Even \
] [get_bd_cells cordic_atan_xy]
create_bd_cell -type hier PS_Amplitude_Controller
create_bd_cell -type hier PS_Phase_Controller

# ---- hierarchy /PAC_PLL/PS_Amplitude_Controller ----
current_bd_instance /PAC_PLL/PS_Amplitude_Controller
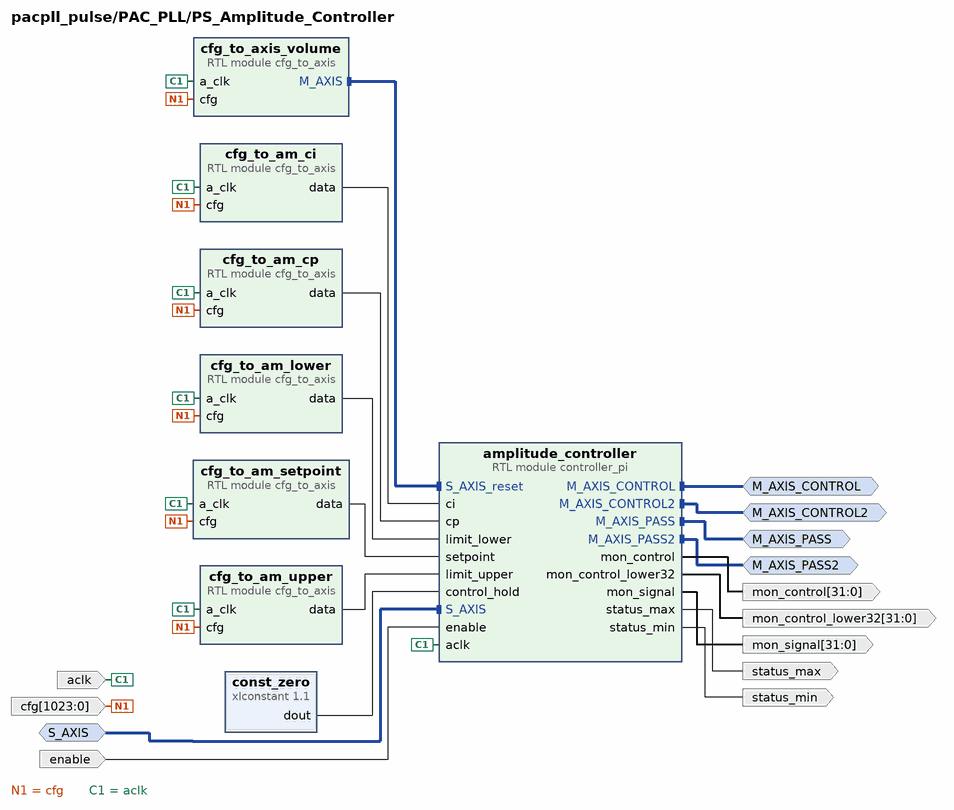
[diagram p6: block diagram inside /PAC_PLL/PS_Amplitude_Controller]
create_bd_intf_pin -mode Master -vlnv xilinx.com:interface:axis_rtl:1.0 M_AXIS_CONTROL
create_bd_intf_pin -mode Master -vlnv xilinx.com:interface:axis_rtl:1.0 M_AXIS_CONTROL2
create_bd_intf_pin -mode Master -vlnv xilinx.com:interface:axis_rtl:1.0 M_AXIS_PASS
create_bd_intf_pin -mode Master -vlnv xilinx.com:interface:axis_rtl:1.0 M_AXIS_PASS2
create_bd_intf_pin -mode Slave -vlnv xilinx.com:interface:axis_rtl:1.0 S_AXIS
create_bd_pin -dir I -type clk aclk
create_bd_pin -dir I -from 1023 -to 0 cfg
create_bd_pin -dir I enable
create_bd_pin -dir O -from 31 -to 0 mon_control
create_bd_pin -dir O -from 31 -to 0 mon_control_lower32
create_bd_pin -dir O -from 31 -to 0 mon_signal
create_bd_pin -dir O status_max
create_bd_pin -dir O status_min

create_bd_cell -type module -reference cfg_to_axis cfg_to_am_ci
set_property -dict {CONFIG.DST_WIDTH 32 CONFIG.MAXIS_TDATA_WIDTH 32 CONFIG.SRC_ADDR 22} [get_bd_cells cfg_to_am_ci]
create_bd_cell -type module -reference cfg_to_axis cfg_to_am_cp
set_property -dict {CONFIG.DST_WIDTH 32 CONFIG.MAXIS_TDATA_WIDTH 32 CONFIG.SRC_ADDR 21} [get_bd_cells cfg_to_am_cp]
create_bd_cell -type module -reference cfg_to_axis cfg_to_am_lower
set_property -dict {CONFIG.DST_WIDTH 16 CONFIG.MAXIS_TDATA_WIDTH 32 CONFIG.SRC_ADDR 25} [get_bd_cells cfg_to_am_lower]
create_bd_cell -type module -reference cfg_to_axis cfg_to_am_setpoint
set_property -dict {CONFIG.DST_WIDTH 24 CONFIG.MAXIS_TDATA_WIDTH 32 CONFIG.SRC_ADDR 20} [get_bd_cells cfg_to_am_setpoint]
create_bd_cell -type module -reference cfg_to_axis cfg_to_am_upper
set_property -dict {CONFIG.DST_WIDTH 16 CONFIG.MAXIS_TDATA_WIDTH 32 CONFIG.SRC_ADDR 23} [get_bd_cells cfg_to_am_upper]
create_bd_cell -type module -reference cfg_to_axis cfg_to_axis_volume
set_property -dict {CONFIG.DST_WIDTH 16 CONFIG.MAXIS_TDATA_WIDTH 16 CONFIG.SRC_ADDR 2} [get_bd_cells cfg_to_axis_volume]
create_bd_cell -type module -reference controller_pi amplitude_controller
set_property -dict [list \
  CONFIG.AMCONTROL_ALLOW_NEG_SPECIAL 1 \
  CONFIG.AXIS_TDATA_WIDTH 24 \
  CONFIG.CONTROL2_W 32 \
  CONFIG.CONTROL_Q 15 \
  CONFIG.CONTROL_W 16 \
  CONFIG.IN_Q 23 \
  CONFIG.IN_W 24 \
  CONFIG.M_AXIS_CONTROL2_TDATA_WIDTH 32 \
  CONFIG.M_AXIS_CONTROL_TDATA_WIDTH 16 \
] [get_bd_cells amplitude_controller]
create_bd_cell -type ip -vlnv xilinx.com:ip:xlconstant:1.1 const_zero
set_property -dict {CONFIG.CONST_VAL 0} [get_bd_cells const_zero]

# ---- hierarchy /PAC_PLL/PS_Phase_Controller ----
current_bd_instance /PAC_PLL/PS_Phase_Controller
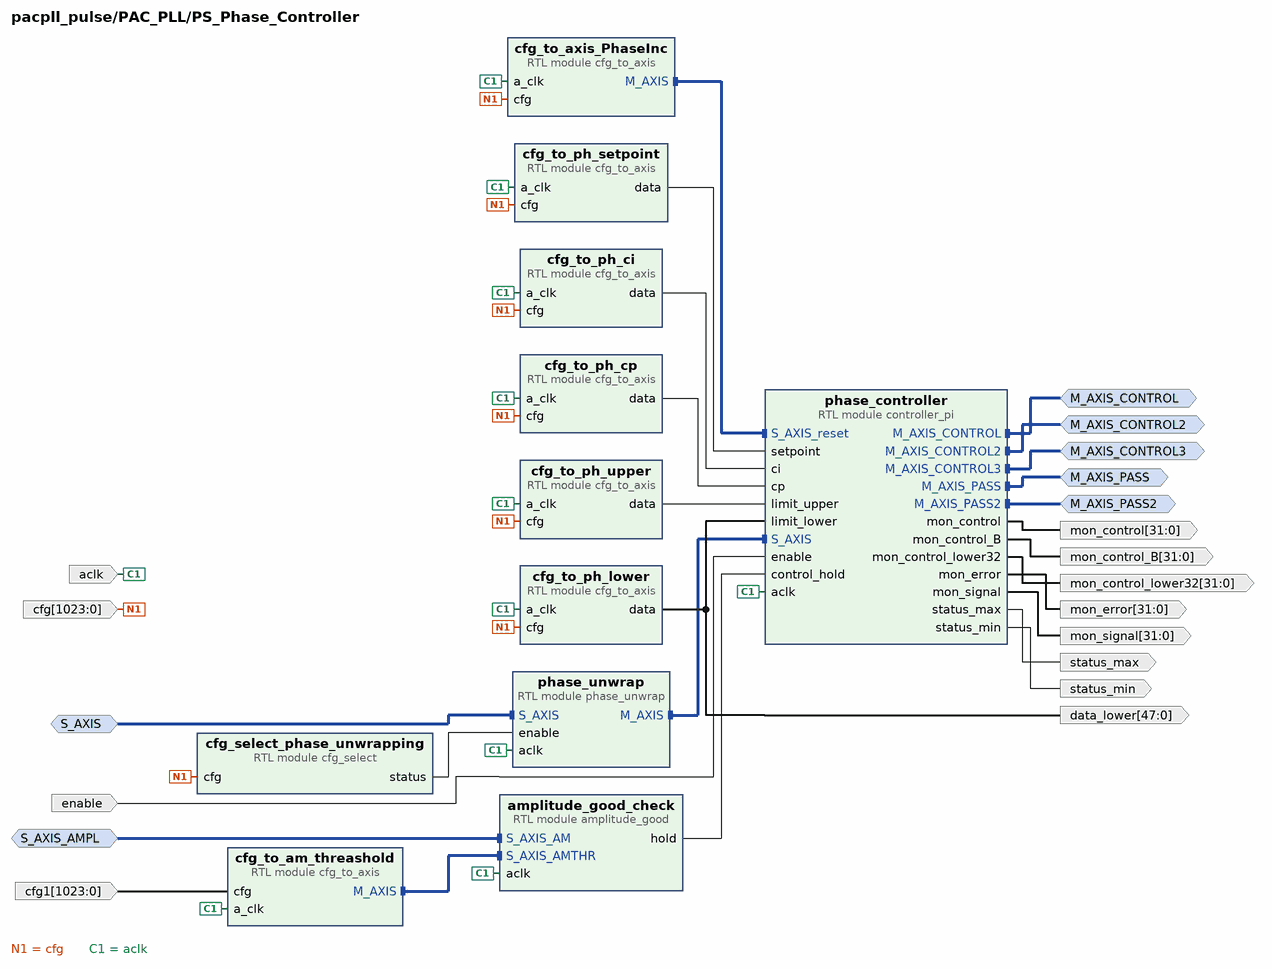
[diagram p7: block diagram inside /PAC_PLL/PS_Phase_Controller]
create_bd_intf_pin -mode Master -vlnv xilinx.com:interface:axis_rtl:1.0 M_AXIS_CONTROL
create_bd_intf_pin -mode Master -vlnv xilinx.com:interface:axis_rtl:1.0 M_AXIS_CONTROL2
create_bd_intf_pin -mode Master -vlnv xilinx.com:interface:axis_rtl:1.0 M_AXIS_PASS
create_bd_intf_pin -mode Master -vlnv xilinx.com:interface:axis_rtl:1.0 M_AXIS_PASS2
create_bd_intf_pin -mode Slave -vlnv xilinx.com:interface:axis_rtl:1.0 S_AXIS
create_bd_intf_pin -mode Master -vlnv xilinx.com:interface:axis_rtl:1.0 M_AXIS_CONTROL3
create_bd_intf_pin -mode Slave -vlnv xilinx.com:interface:axis_rtl:1.0 S_AXIS_AMPL
create_bd_pin -dir I -type clk aclk
create_bd_pin -dir I -from 1023 -to 0 cfg
create_bd_pin -dir O -from 47 -to 0 data_lower
create_bd_pin -dir I enable
create_bd_pin -dir O -from 31 -to 0 mon_control
create_bd_pin -dir O -from 31 -to 0 mon_control_B
create_bd_pin -dir O -from 31 -to 0 mon_control_lower32
create_bd_pin -dir O -from 31 -to 0 mon_error
create_bd_pin -dir O -from 31 -to 0 mon_signal
create_bd_pin -dir O status_max
create_bd_pin -dir O status_min
create_bd_pin -dir I -from 1023 -to 0 cfg1

create_bd_cell -type module -reference amplitude_good amplitude_good_check
set_property -dict {CONFIG.AXIS_TDATA_WIDTH 24} [get_bd_cells amplitude_good_check]
create_bd_cell -type module -reference cfg_select cfg_select_phase_unwrapping
set_property -dict {CONFIG.CFG_SWBIT 2 CONFIG.SRC_ADDR 3} [get_bd_cells cfg_select_phase_unwrapping]
create_bd_cell -type module -reference cfg_to_axis cfg_to_axis_PhaseInc
set_property -dict {CONFIG.DST_WIDTH 48 CONFIG.MAXIS_TDATA_WIDTH 48 CONFIG.SRC_BITS 64} [get_bd_cells cfg_to_axis_PhaseInc]
create_bd_cell -type module -reference cfg_to_axis cfg_to_ph_ci
set_property -dict [list \
  CONFIG.DST_WIDTH 32 \
  CONFIG.MAXIS_TDATA_WIDTH 32 \
  CONFIG.SRC_ADDR 12 \
  CONFIG.SRC_BITS 32 \
] [get_bd_cells cfg_to_ph_ci]
create_bd_cell -type module -reference cfg_to_axis cfg_to_ph_cp
set_property -dict [list \
  CONFIG.DST_WIDTH 32 \
  CONFIG.MAXIS_TDATA_WIDTH 32 \
  CONFIG.SRC_ADDR 11 \
  CONFIG.SRC_BITS 32 \
] [get_bd_cells cfg_to_ph_cp]
create_bd_cell -type module -reference cfg_to_axis cfg_to_ph_lower
set_property -dict [list \
  CONFIG.DST_WIDTH 48 \
  CONFIG.MAXIS_TDATA_WIDTH 48 \
  CONFIG.SRC_ADDR 15 \
  CONFIG.SRC_BITS 64 \
] [get_bd_cells cfg_to_ph_lower]
create_bd_cell -type module -reference cfg_to_axis cfg_to_ph_setpoint
set_property -dict {CONFIG.DST_WIDTH 32 CONFIG.MAXIS_TDATA_WIDTH 32 CONFIG.SRC_ADDR 10} [get_bd_cells cfg_to_ph_setpoint]
create_bd_cell -type module -reference cfg_to_axis cfg_to_ph_upper
set_property -dict [list \
  CONFIG.DST_WIDTH 48 \
  CONFIG.MAXIS_TDATA_WIDTH 48 \
  CONFIG.SRC_ADDR 13 \
  CONFIG.SRC_BITS 64 \
] [get_bd_cells cfg_to_ph_upper]
create_bd_cell -type module -reference cfg_to_axis cfg_to_am_threashold
set_property -dict [list \
  CONFIG.CFG_WIDTH 1024 \
  CONFIG.DST_WIDTH 24 \
  CONFIG.MAXIS_TDATA_WIDTH 24 \
  CONFIG.SRC_ADDR 8 \
] [get_bd_cells cfg_to_am_threashold]
create_bd_cell -type module -reference phase_unwrap phase_unwrap
set_property -dict {CONFIG.PHU_DISABLE 1} [get_bd_cells phase_unwrap]
create_bd_cell -type module -reference controller_pi phase_controller
set_property -dict [list \
  CONFIG.AMCONTROL_ALLOW_NEG_SPECIAL 0 \
  CONFIG.AUTO_RESET_AT_LIMIT 0 \
  CONFIG.AXIS_TDATA_WIDTH 32 \
  CONFIG.CONTROL2_W 44 \
  CONFIG.IN_Q 21 \
  CONFIG.IN_W 24 \
  CONFIG.M_AXIS_CONTROL2_TDATA_WIDTH 48 \
  CONFIG.M_AXIS_CONTROL_TDATA_WIDTH 48 \
  CONFIG.RDECI 8 \
] [get_bd_cells phase_controller]

# ---- hierarchy /Block_QControl ----
current_bd_instance /Block_QControl
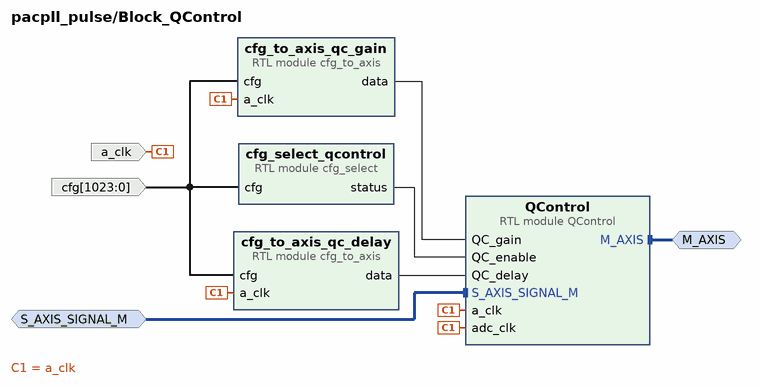
[diagram p8: block diagram inside /Block_QControl]
create_bd_intf_pin -mode Master -vlnv xilinx.com:interface:axis_rtl:1.0 M_AXIS
create_bd_intf_pin -mode Slave -vlnv xilinx.com:interface:axis_rtl:1.0 S_AXIS_SIGNAL_M
create_bd_pin -dir I -from 1023 -to 0 cfg
create_bd_pin -dir I -type clk a_clk

create_bd_cell -type module -reference cfg_select cfg_select_qcontrol
set_property -dict {CONFIG.CFG_SWBIT 3 CONFIG.SRC_ADDR 3} [get_bd_cells cfg_select_qcontrol]
create_bd_cell -type module -reference cfg_to_axis cfg_to_axis_qc_delay
set_property -dict {CONFIG.DST_WIDTH 16 CONFIG.SRC_ADDR 29 CONFIG.SRC_BITS 16} [get_bd_cells cfg_to_axis_qc_delay]
create_bd_cell -type module -reference QControl QControl
create_bd_cell -type module -reference cfg_to_axis cfg_to_axis_qc_gain
set_property -dict {CONFIG.DST_WIDTH 16 CONFIG.SRC_ADDR 29 CONFIG.SRC_BITS 32} [get_bd_cells cfg_to_axis_qc_gain]

# ---- hierarchy /SPM_control_logic ----
current_bd_instance /SPM_control_logic
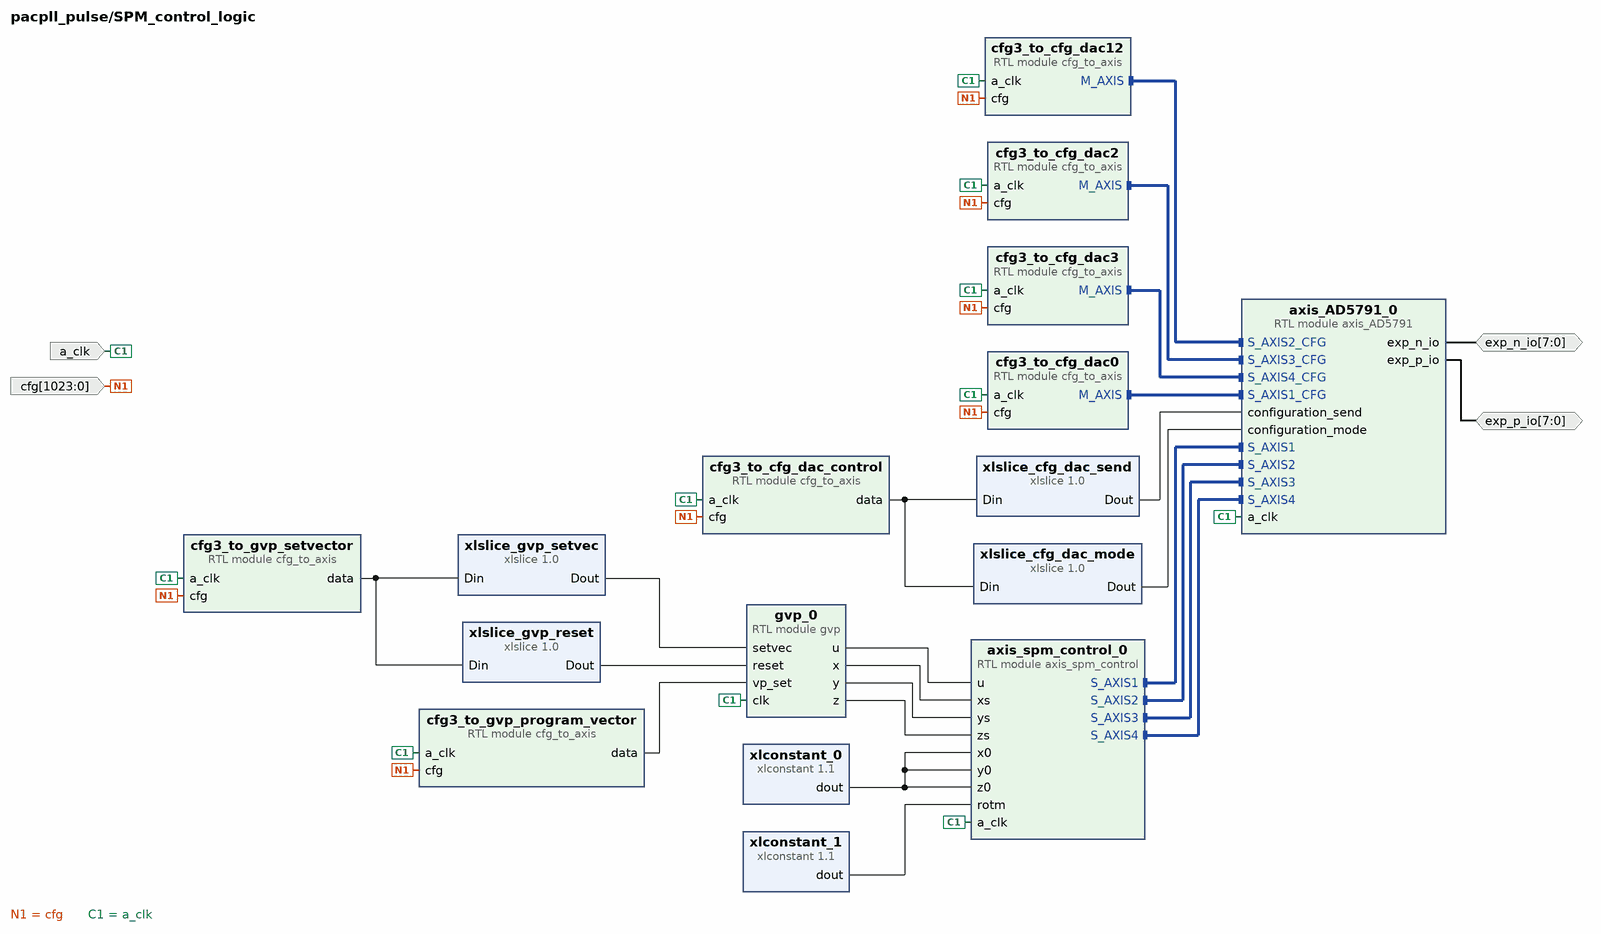
[diagram p9: block diagram inside /SPM_control_logic]
create_bd_pin -dir I -from 1023 -to 0 cfg
create_bd_pin -dir I -type clk a_clk
create_bd_pin -dir IO -from 7 -to 0 exp_p_io
create_bd_pin -dir IO -from 7 -to 0 exp_n_io

create_bd_cell -type module -reference cfg_to_axis cfg3_to_cfg_dac3
set_property -dict [list \
  CONFIG.DST_WIDTH 32 \
  CONFIG.MAXIS_TDATA_WIDTH 32 \
  CONFIG.SRC_ADDR 516 \
  CONFIG.SRC_BITS 32 \
] [get_bd_cells cfg3_to_cfg_dac3]
create_bd_cell -type ip -vlnv xilinx.com:ip:xlslice:1.0 xlslice_gvp_setvec
set_property -dict {CONFIG.DIN_FROM 1 CONFIG.DIN_TO 1 CONFIG.DOUT_WIDTH 1} [get_bd_cells xlslice_gvp_setvec]
create_bd_cell -type module -reference cfg_to_axis cfg3_to_gvp_setvector
set_property -dict [list \
  CONFIG.DST_WIDTH 32 \
  CONFIG.MAXIS_TDATA_WIDTH 32 \
  CONFIG.SRC_ADDR 0 \
  CONFIG.SRC_BITS 32 \
] [get_bd_cells cfg3_to_gvp_setvector]
create_bd_cell -type ip -vlnv xilinx.com:ip:xlconstant:1.1 xlconstant_0
set_property -dict {CONFIG.CONST_VAL 0 CONFIG.CONST_WIDTH 32} [get_bd_cells xlconstant_0]
create_bd_cell -type module -reference cfg_to_axis cfg3_to_gvp_program_vector
set_property -dict [list \
  CONFIG.DST_WIDTH 512 \
  CONFIG.MAXIS_TDATA_WIDTH 512 \
  CONFIG.SRC_ADDR 1 \
  CONFIG.SRC_BITS 512 \
] [get_bd_cells cfg3_to_gvp_program_vector]
create_bd_cell -type ip -vlnv xilinx.com:ip:xlslice:1.0 xlslice_cfg_dac_mode
create_bd_cell -type module -reference axis_AD5791 axis_AD5791_0
create_bd_cell -type ip -vlnv xilinx.com:ip:xlslice:1.0 xlslice_cfg_dac_send
set_property -dict {CONFIG.DIN_FROM 1 CONFIG.DIN_TO 1 CONFIG.DOUT_WIDTH 1} [get_bd_cells xlslice_cfg_dac_send]
create_bd_cell -type ip -vlnv xilinx.com:ip:xlconstant:1.1 xlconstant_1
set_property -dict {CONFIG.CONST_VAL 0 CONFIG.CONST_WIDTH 128} [get_bd_cells xlconstant_1]
create_bd_cell -type ip -vlnv xilinx.com:ip:xlslice:1.0 xlslice_gvp_reset
set_property -dict {CONFIG.DIN_FROM 0 CONFIG.DIN_TO 0 CONFIG.DOUT_WIDTH 1} [get_bd_cells xlslice_gvp_reset]
create_bd_cell -type module -reference cfg_to_axis cfg3_to_cfg_dac_control
set_property -dict [list \
  CONFIG.DST_WIDTH 32 \
  CONFIG.MAXIS_TDATA_WIDTH 32 \
  CONFIG.SRC_ADDR 517 \
  CONFIG.SRC_BITS 32 \
] [get_bd_cells cfg3_to_cfg_dac_control]
create_bd_cell -type module -reference axis_spm_control axis_spm_control_0
create_bd_cell -type module -reference cfg_to_axis cfg3_to_cfg_dac12
set_property -dict [list \
  CONFIG.DST_WIDTH 32 \
  CONFIG.MAXIS_TDATA_WIDTH 32 \
  CONFIG.SRC_ADDR 514 \
  CONFIG.SRC_BITS 32 \
] [get_bd_cells cfg3_to_cfg_dac12]
create_bd_cell -type module -reference gvp gvp_0
create_bd_cell -type module -reference cfg_to_axis cfg3_to_cfg_dac2
set_property -dict [list \
  CONFIG.DST_WIDTH 32 \
  CONFIG.MAXIS_TDATA_WIDTH 32 \
  CONFIG.SRC_ADDR 515 \
  CONFIG.SRC_BITS 32 \
] [get_bd_cells cfg3_to_cfg_dac2]
create_bd_cell -type module -reference cfg_to_axis cfg3_to_cfg_dac0
set_property -dict [list \
  CONFIG.DST_WIDTH 32 \
  CONFIG.MAXIS_TDATA_WIDTH 32 \
  CONFIG.SRC_ADDR 513 \
  CONFIG.SRC_BITS 32 \
] [get_bd_cells cfg3_to_cfg_dac0]

# ---- connections ----

current_bd_instance /PS
connect_bd_intf_net [get_bd_intf_pins BRAM_PORTA] [get_bd_intf_pins axi_bram_reader_0/BRAM_PORTA]
connect_bd_intf_net [get_bd_intf_pins axi_cfg_register_0/S_AXI] [get_bd_intf_pins axi_interconnect_0/M00_AXI]
connect_bd_intf_net [get_bd_intf_pins axi_gpio_0/S_AXI] [get_bd_intf_pins axi_interconnect_0/M01_AXI]
connect_bd_intf_net [get_bd_intf_pins axi_gpio_1/S_AXI] [get_bd_intf_pins axi_interconnect_0/M02_AXI]
connect_bd_intf_net [get_bd_intf_pins axi_gpio_2/S_AXI] [get_bd_intf_pins axi_interconnect_0/M03_AXI]
connect_bd_intf_net [get_bd_intf_pins axi_gpio_3/S_AXI] [get_bd_intf_pins axi_interconnect_0/M04_AXI]
connect_bd_intf_net [get_bd_intf_pins axi_gpio_4/S_AXI] [get_bd_intf_pins axi_interconnect_0/M05_AXI]
connect_bd_intf_net [get_bd_intf_pins axi_bram_reader_0/S_AXI] [get_bd_intf_pins axi_interconnect_0/M06_AXI]
connect_bd_intf_net [get_bd_intf_pins axi_gpio_5/S_AXI] [get_bd_intf_pins axi_interconnect_0/M07_AXI]
connect_bd_intf_net [get_bd_intf_pins axi_gpio_6/S_AXI] [get_bd_intf_pins axi_interconnect_0/M08_AXI]
connect_bd_intf_net [get_bd_intf_pins DDR] [get_bd_intf_pins processing_system7_0/DDR]
connect_bd_intf_net [get_bd_intf_pins FIXED_IO] [get_bd_intf_pins processing_system7_0/FIXED_IO]
connect_bd_intf_net [get_bd_intf_pins axi_interconnect_0/S00_AXI] [get_bd_intf_pins processing_system7_0/M_AXI_GP0]
connect_bd_net [get_bd_pins processing_system7_0/FCLK_CLK0] \
  [get_bd_pins axi_bram_reader_0/s00_axi_aclk] [get_bd_pins axi_cfg_register_0/aclk] \
  [get_bd_pins processing_system7_0/M_AXI_GP0_ACLK] [get_bd_pins processing_system7_0/S_AXI_ACP_ACLK] \
  [get_bd_pins rst_ps7_0_125M/slowest_sync_clk] [get_bd_pins axi_gpio_0/s_axi_aclk] [get_bd_pins axi_gpio_1/s_axi_aclk] \
  [get_bd_pins axi_gpio_2/s_axi_aclk] [get_bd_pins axi_gpio_3/s_axi_aclk] [get_bd_pins axi_gpio_4/s_axi_aclk] \
  [get_bd_pins axi_gpio_5/s_axi_aclk] [get_bd_pins axi_gpio_6/s_axi_aclk] [get_bd_pins axi_interconnect_0/ACLK] \
  [get_bd_pins axi_interconnect_0/S00_ACLK] [get_bd_pins axi_interconnect_0/M00_ACLK] \
  [get_bd_pins axi_interconnect_0/M01_ACLK] [get_bd_pins axi_interconnect_0/M02_ACLK] \
  [get_bd_pins axi_interconnect_0/M03_ACLK] [get_bd_pins axi_interconnect_0/M04_ACLK] \
  [get_bd_pins axi_interconnect_0/M05_ACLK] [get_bd_pins axi_interconnect_0/M06_ACLK] \
  [get_bd_pins axi_interconnect_0/M07_ACLK] [get_bd_pins axi_interconnect_0/M08_ACLK] \
  [get_bd_pins axi_interconnect_0/M09_ACLK]
connect_bd_net [get_bd_pins axi_cfg_register_0/cfg_data] \
  [get_bd_pins xlslice_cfg_reg1/Din] [get_bd_pins xlslice_cfg_reg0/Din] [get_bd_pins xlslice_cfg_reg2/Din] \
  [get_bd_pins xlslice_cfg_reg3/Din]
connect_bd_net -net gpio2_io_i1_1 [get_bd_pins gpio_io_1_x4] [get_bd_pins axi_gpio_1/gpio2_io_i]
connect_bd_net -net gpio2_io_i3_1 [get_bd_pins gpio_io_3_x8] [get_bd_pins axi_gpio_3/gpio2_io_i]
connect_bd_net -net gpio2_io_i4_1 [get_bd_pins gpio_io_2_x6] [get_bd_pins axi_gpio_2/gpio2_io_i]
connect_bd_net -net gpio2_io_i_1 [get_bd_pins gpio_io_0_x2] [get_bd_pins axi_gpio_0/gpio2_io_i]
connect_bd_net -net gpio2_io_i_2 [get_bd_pins gpio_io_4_x10] [get_bd_pins axi_gpio_4/gpio2_io_i]
connect_bd_net -net gpio2_io_i_3 [get_bd_pins gpio_io_5_x12] [get_bd_pins axi_gpio_5/gpio2_io_i]
connect_bd_net -net gpio2_io_i_4 [get_bd_pins gpio_io_6_x14] [get_bd_pins axi_gpio_6/gpio2_io_i]
connect_bd_net -net gpio_io_i1_1 [get_bd_pins gpio_io_1_x3] [get_bd_pins axi_gpio_1/gpio_io_i]
connect_bd_net -net gpio_io_i3_1 [get_bd_pins gpio_io_3_x7] [get_bd_pins axi_gpio_3/gpio_io_i]
connect_bd_net -net gpio_io_i4_1 [get_bd_pins gpio_io_2_x5] [get_bd_pins axi_gpio_2/gpio_io_i]
connect_bd_net -net gpio_io_i_1 [get_bd_pins gpio_io_0_x1] [get_bd_pins axi_gpio_0/gpio_io_i]
connect_bd_net -net gpio_io_i_2 [get_bd_pins gpio_io_4_x9] [get_bd_pins axi_gpio_4/gpio_io_i]
connect_bd_net -net gpio_io_i_3 [get_bd_pins gpio_io_5_x11] [get_bd_pins axi_gpio_5/gpio_io_i]
connect_bd_net [get_bd_pins gpio_io_i] [get_bd_pins axi_gpio_6/gpio_io_i]
connect_bd_net [get_bd_pins processing_system7_0/FCLK_RESET0_N] [get_bd_pins rst_ps7_0_125M/ext_reset_in]
connect_bd_net [get_bd_pins rst_ps7_0_125M/interconnect_aresetn] [get_bd_pins axi_interconnect_0/ARESETN]
connect_bd_net [get_bd_pins rst_ps7_0_125M/peripheral_aresetn] \
  [get_bd_pins axi_bram_reader_0/s00_axi_aresetn] [get_bd_pins axi_cfg_register_0/aresetn] \
  [get_bd_pins axi_gpio_0/s_axi_aresetn] [get_bd_pins axi_gpio_1/s_axi_aresetn] [get_bd_pins axi_gpio_2/s_axi_aresetn] \
  [get_bd_pins axi_gpio_3/s_axi_aresetn] [get_bd_pins axi_gpio_4/s_axi_aresetn] [get_bd_pins axi_gpio_5/s_axi_aresetn] \
  [get_bd_pins axi_gpio_6/s_axi_aresetn] [get_bd_pins axi_interconnect_0/S00_ARESETN] \
  [get_bd_pins axi_interconnect_0/M00_ARESETN] [get_bd_pins axi_interconnect_0/M01_ARESETN] \
  [get_bd_pins axi_interconnect_0/M02_ARESETN] [get_bd_pins axi_interconnect_0/M03_ARESETN] \
  [get_bd_pins axi_interconnect_0/M04_ARESETN] [get_bd_pins axi_interconnect_0/M05_ARESETN] \
  [get_bd_pins axi_interconnect_0/M06_ARESETN] [get_bd_pins axi_interconnect_0/M07_ARESETN] \
  [get_bd_pins axi_interconnect_0/M08_ARESETN] [get_bd_pins axi_interconnect_0/M09_ARESETN]
connect_bd_net [get_bd_pins xlslice_cfg_reg0/Dout] [get_bd_pins cfg_data_reg_0]
connect_bd_net [get_bd_pins xlslice_cfg_reg1/Dout] [get_bd_pins cfg_data_reg_1]
connect_bd_net [get_bd_pins xlslice_cfg_reg2/Dout] [get_bd_pins cfg_data_reg_2]
connect_bd_net [get_bd_pins xlslice_cfg_reg3/Dout] [get_bd_pins cfg_data_reg_3]

current_bd_instance /PS_data_transport
connect_bd_intf_net [get_bd_intf_pins S_AXIS7] [get_bd_intf_pins axis_4s_combine_decimate/S_AXIS7]
connect_bd_intf_net [get_bd_intf_pins S_AXIS8] [get_bd_intf_pins axis_4s_combine_decimate/S_AXIS8]
connect_bd_intf_net [get_bd_intf_pins S_AXIS6] [get_bd_intf_pins axis_4s_combine_decimate/S_AXIS6]
connect_bd_intf_net [get_bd_intf_pins S_AXIS2] [get_bd_intf_pins axis_4s_combine_decimate/S_AXIS2]
connect_bd_intf_net [get_bd_intf_pins S_AXIS5] [get_bd_intf_pins axis_4s_combine_decimate/S_AXIS5]
connect_bd_intf_net [get_bd_intf_pins BRAM_PORTB] [get_bd_intf_pins blk_mem_gen_0/BRAM_PORTB]
connect_bd_intf_net [get_bd_intf_pins S_AXIS3] [get_bd_intf_pins axis_4s_combine_decimate/S_AXIS3]
connect_bd_intf_net [get_bd_intf_pins S_AXIS4] [get_bd_intf_pins axis_4s_combine_decimate/S_AXIS4]
connect_bd_intf_net [get_bd_intf_pins M_AXIS_aux] [get_bd_intf_pins PulseFormer/M_AXIS]
connect_bd_intf_net [get_bd_intf_pins axis_4s_combine_decimate/M_AXIS_CH1] [get_bd_intf_pins axis_FIR_CH1/S_AXIS]
connect_bd_intf_net [get_bd_intf_pins axis_4s_combine_decimate/M_AXIS_CH2] [get_bd_intf_pins axis_FIR_CH2/S_AXIS]
connect_bd_intf_net [get_bd_intf_pins axis_FIR_CH3/S_AXIS] [get_bd_intf_pins axis_4s_combine_decimate/M_AXIS_CH3]
connect_bd_intf_net [get_bd_intf_pins axis_FIR_CH4/S_AXIS] [get_bd_intf_pins axis_4s_combine_decimate/M_AXIS_CH4]
connect_bd_intf_net [get_bd_intf_pins axis_4s_combine_decimate/M_AXIS_DFREQ_DEC2] [get_bd_intf_pins controller_dfreq/S_AXIS]
connect_bd_intf_net [get_bd_intf_pins axis_4s_combine_decimate/S_AXIS1S] [get_bd_intf_pins controller_dfreq/M_AXIS_CONTROL2]
connect_bd_intf_net [get_bd_intf_pins S_AXIS1] [get_bd_intf_pins axis_4s_combine_decimate/S_AXIS1]
connect_bd_net [get_bd_pins a2_clk] [get_bd_pins axis_bram_push2ch64/a2_clk] [get_bd_pins controller_dfreq/a_clk]
connect_bd_net -net axis_4s_combine_0_BR_ch1s [get_bd_pins axis_4s_combine_decimate/BR_ch1s] [get_bd_pins axis_bram_push2ch64/ch1s]
connect_bd_net -net axis_4s_combine_0_BR_ch2s [get_bd_pins axis_4s_combine_decimate/BR_ch2s] [get_bd_pins axis_bram_push2ch64/ch2s]
connect_bd_net -net axis_4s_combine_0_BR_reset [get_bd_pins axis_4s_combine_decimate/BR_reset] [get_bd_pins axis_bram_push2ch64/reset]
connect_bd_net -net axis_4s_combine_0_bram_porta_addr [get_bd_pins axis_bram_push2ch64/BRAM_PORTA_addr] [get_bd_pins blk_mem_gen_0/addra]
connect_bd_net -net axis_4s_combine_0_bram_porta_clk [get_bd_pins axis_bram_push2ch64/BRAM_PORTA_clk] [get_bd_pins blk_mem_gen_0/clka]
connect_bd_net -net axis_4s_combine_0_bram_porta_en [get_bd_pins axis_bram_push2ch64/BRAM_PORTA_en] [get_bd_pins blk_mem_gen_0/ena]
connect_bd_net -net axis_4s_combine_0_bram_porta_we [get_bd_pins axis_bram_push2ch64/BRAM_PORTA_we] [get_bd_pins blk_mem_gen_0/wea]
connect_bd_net -net axis_4s_combine_0_bram_porta_wrdata [get_bd_pins axis_bram_push2ch64/BRAM_PORTA_din] [get_bd_pins blk_mem_gen_0/dina]
connect_bd_net -net axis_4s_combine_0_writeposition [get_bd_pins axis_4s_combine_decimate/writeposition] [get_bd_pins writeposition]
connect_bd_net [get_bd_pins axis_4s_combine_decimate/BR_next] [get_bd_pins axis_bram_push2ch64/push_next]
connect_bd_net [get_bd_pins axis_4s_combine_decimate/FIR_next] \
  [get_bd_pins axis_FIR_CH1/next_dv] [get_bd_pins axis_FIR_CH2/next_dv] [get_bd_pins axis_FIR_CH3/next_dv] \
  [get_bd_pins axis_FIR_CH4/next_dv]
connect_bd_net [get_bd_pins axis_4s_combine_decimate/delta_frequency_monitor] [get_bd_pins delta_frequency_monitor]
connect_bd_net [get_bd_pins axis_bram_push2ch64/last_write_addr] [get_bd_pins axis_4s_combine_decimate/BR_wpos]
connect_bd_net -net axis_bram_push_0_ready [get_bd_pins axis_bram_push2ch64/ready] [get_bd_pins axis_4s_combine_decimate/BR_ready]
connect_bd_net -net axis_red_pitaya_adc_0_adc_clk [get_bd_pins a_clk] \
  [get_bd_pins axis_FIR_CH1/a_clk] [get_bd_pins axis_FIR_CH2/a_clk] [get_bd_pins cfg18_19_to_transport_auxcenter/a_clk] \
  [get_bd_pins cfg_to_transport_channel_select/a_clk] [get_bd_pins cfg_to_transport_control/a_clk] \
  [get_bd_pins cfg_to_transport_decimation/a_clk] [get_bd_pins cfg_to_transport_nsamples/a_clk] \
  [get_bd_pins axis_4s_combine_decimate/a_clk] [get_bd_pins axis_FIR_CH3/a_clk] [get_bd_pins axis_FIR_CH4/a_clk] \
  [get_bd_pins PulseFormer/a_clk]
connect_bd_net [get_bd_pins cfg18_19_to_transport_auxcenter/data] [get_bd_pins axis_4s_combine_decimate/axis3_center]
connect_bd_net -net cfg2_1 [get_bd_pins cfg2] [get_bd_pins PulseFormer/cfg2]
connect_bd_net [get_bd_pins cfg0] \
  [get_bd_pins cfg18_19_to_transport_auxcenter/cfg] [get_bd_pins cfg_to_transport_channel_select/cfg] \
  [get_bd_pins cfg_to_transport_control/cfg] [get_bd_pins cfg_to_transport_decimation/cfg] \
  [get_bd_pins cfg_to_transport_nsamples/cfg] [get_bd_pins controller_dfreq/cfg1]
connect_bd_net [get_bd_pins cfg] [get_bd_pins controller_dfreq/cfg]
connect_bd_net -net cfg_to_channel_select_data [get_bd_pins cfg_to_transport_channel_select/data] \
  [get_bd_pins axis_4s_combine_decimate/channel_selector]
connect_bd_net -net cfg_to_transport_channel_select1_data [get_bd_pins cfg_to_transport_nsamples/data] [get_bd_pins axis_4s_combine_decimate/nsamples]
connect_bd_net [get_bd_pins cfg_to_transport_control/data] [get_bd_pins axis_4s_combine_decimate/operation]
connect_bd_net -net cfg_to_transport_data [get_bd_pins cfg_to_transport_decimation/data] [get_bd_pins axis_4s_combine_decimate/ndecimate]
connect_bd_net [get_bd_pins const_zero1/dout] [get_bd_pins controller_dfreq/S_AXIS_reset_tdata]
connect_bd_net [get_bd_pins const_zero/dout] [get_bd_pins controller_dfreq/control_hold]
connect_bd_net [get_bd_pins controller_dfreq/enable] [get_bd_pins enable]
connect_bd_net [get_bd_pins controller_dfreq/mon_control] [get_bd_pins mon_control]
connect_bd_net [get_bd_pins zero_spcp] [get_bd_pins PulseFormer/zero_spcp]
